# EasyEDA schematic SCH_OSHW_BiDi_SDI_Fiber_Converter_V4_Normal_2024-11-17.json

## Sheets
1 SFP: TITLE: Sheet_1; REV: 1.0; Date: 2024-07-08; Sheet: 1/1; Drawn By: TheStaticTurtle; Company: Your Company
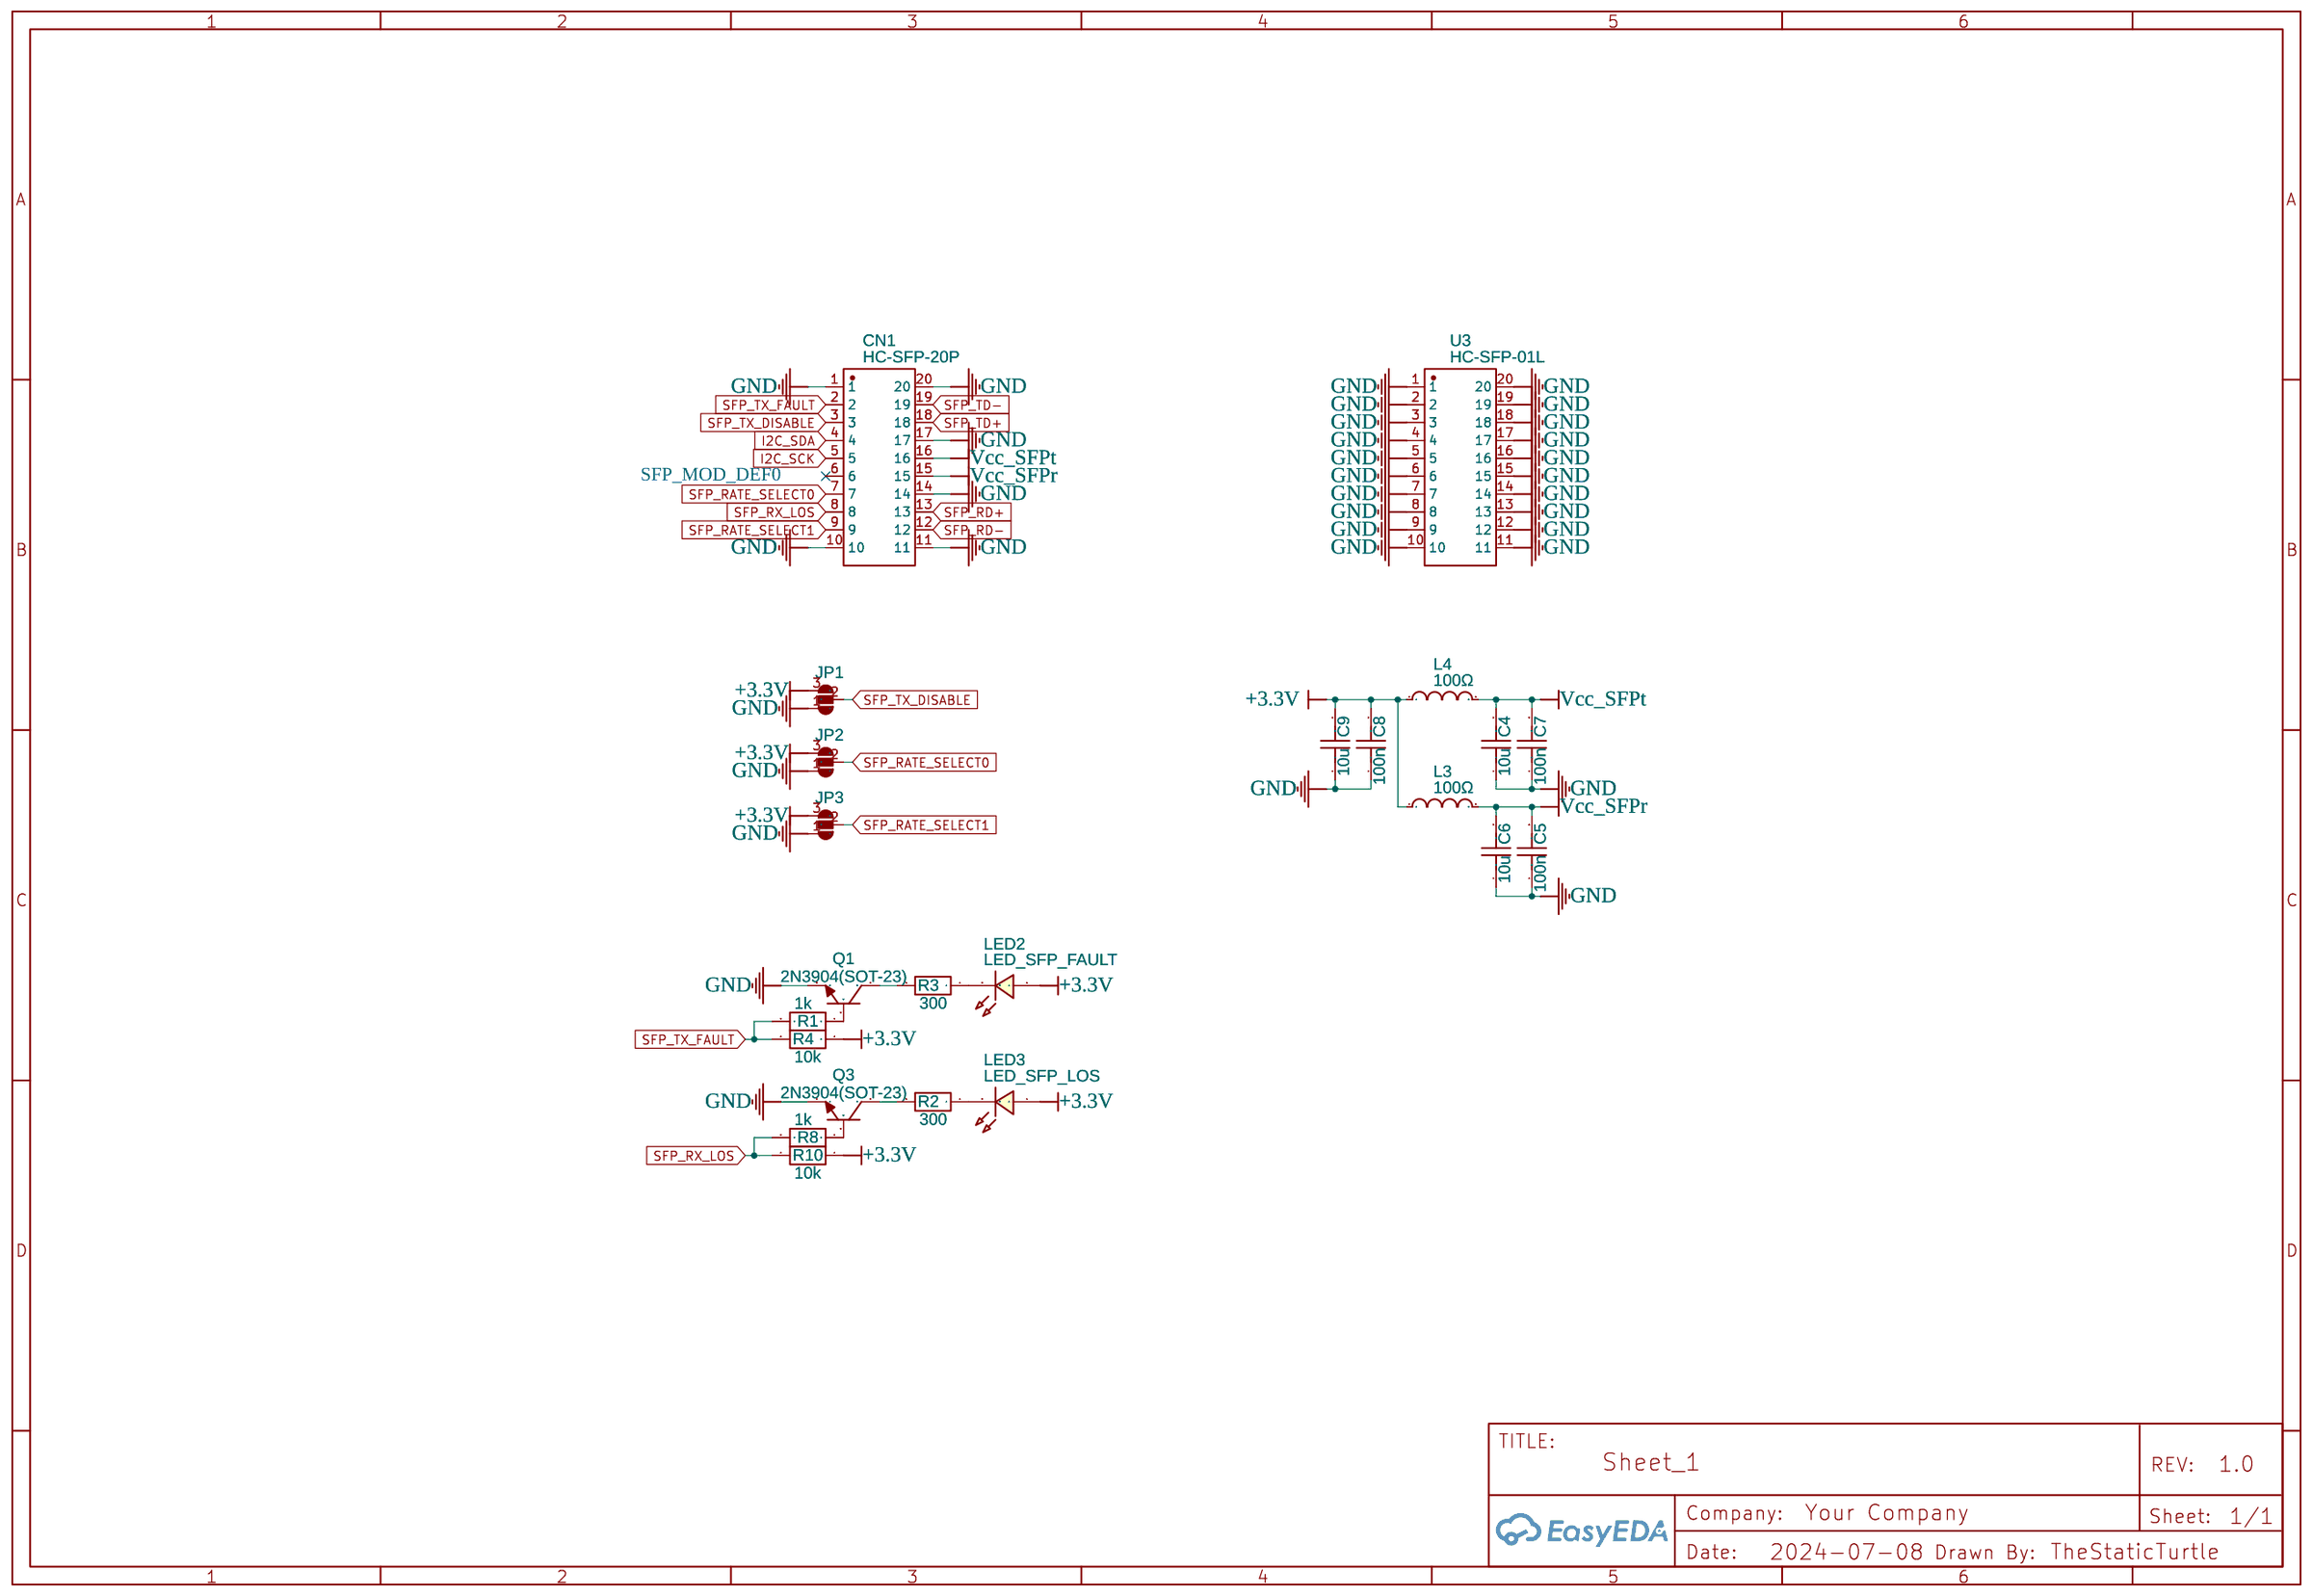
[diagram p0: SFP]
2 Power: Date: 2024-09-07
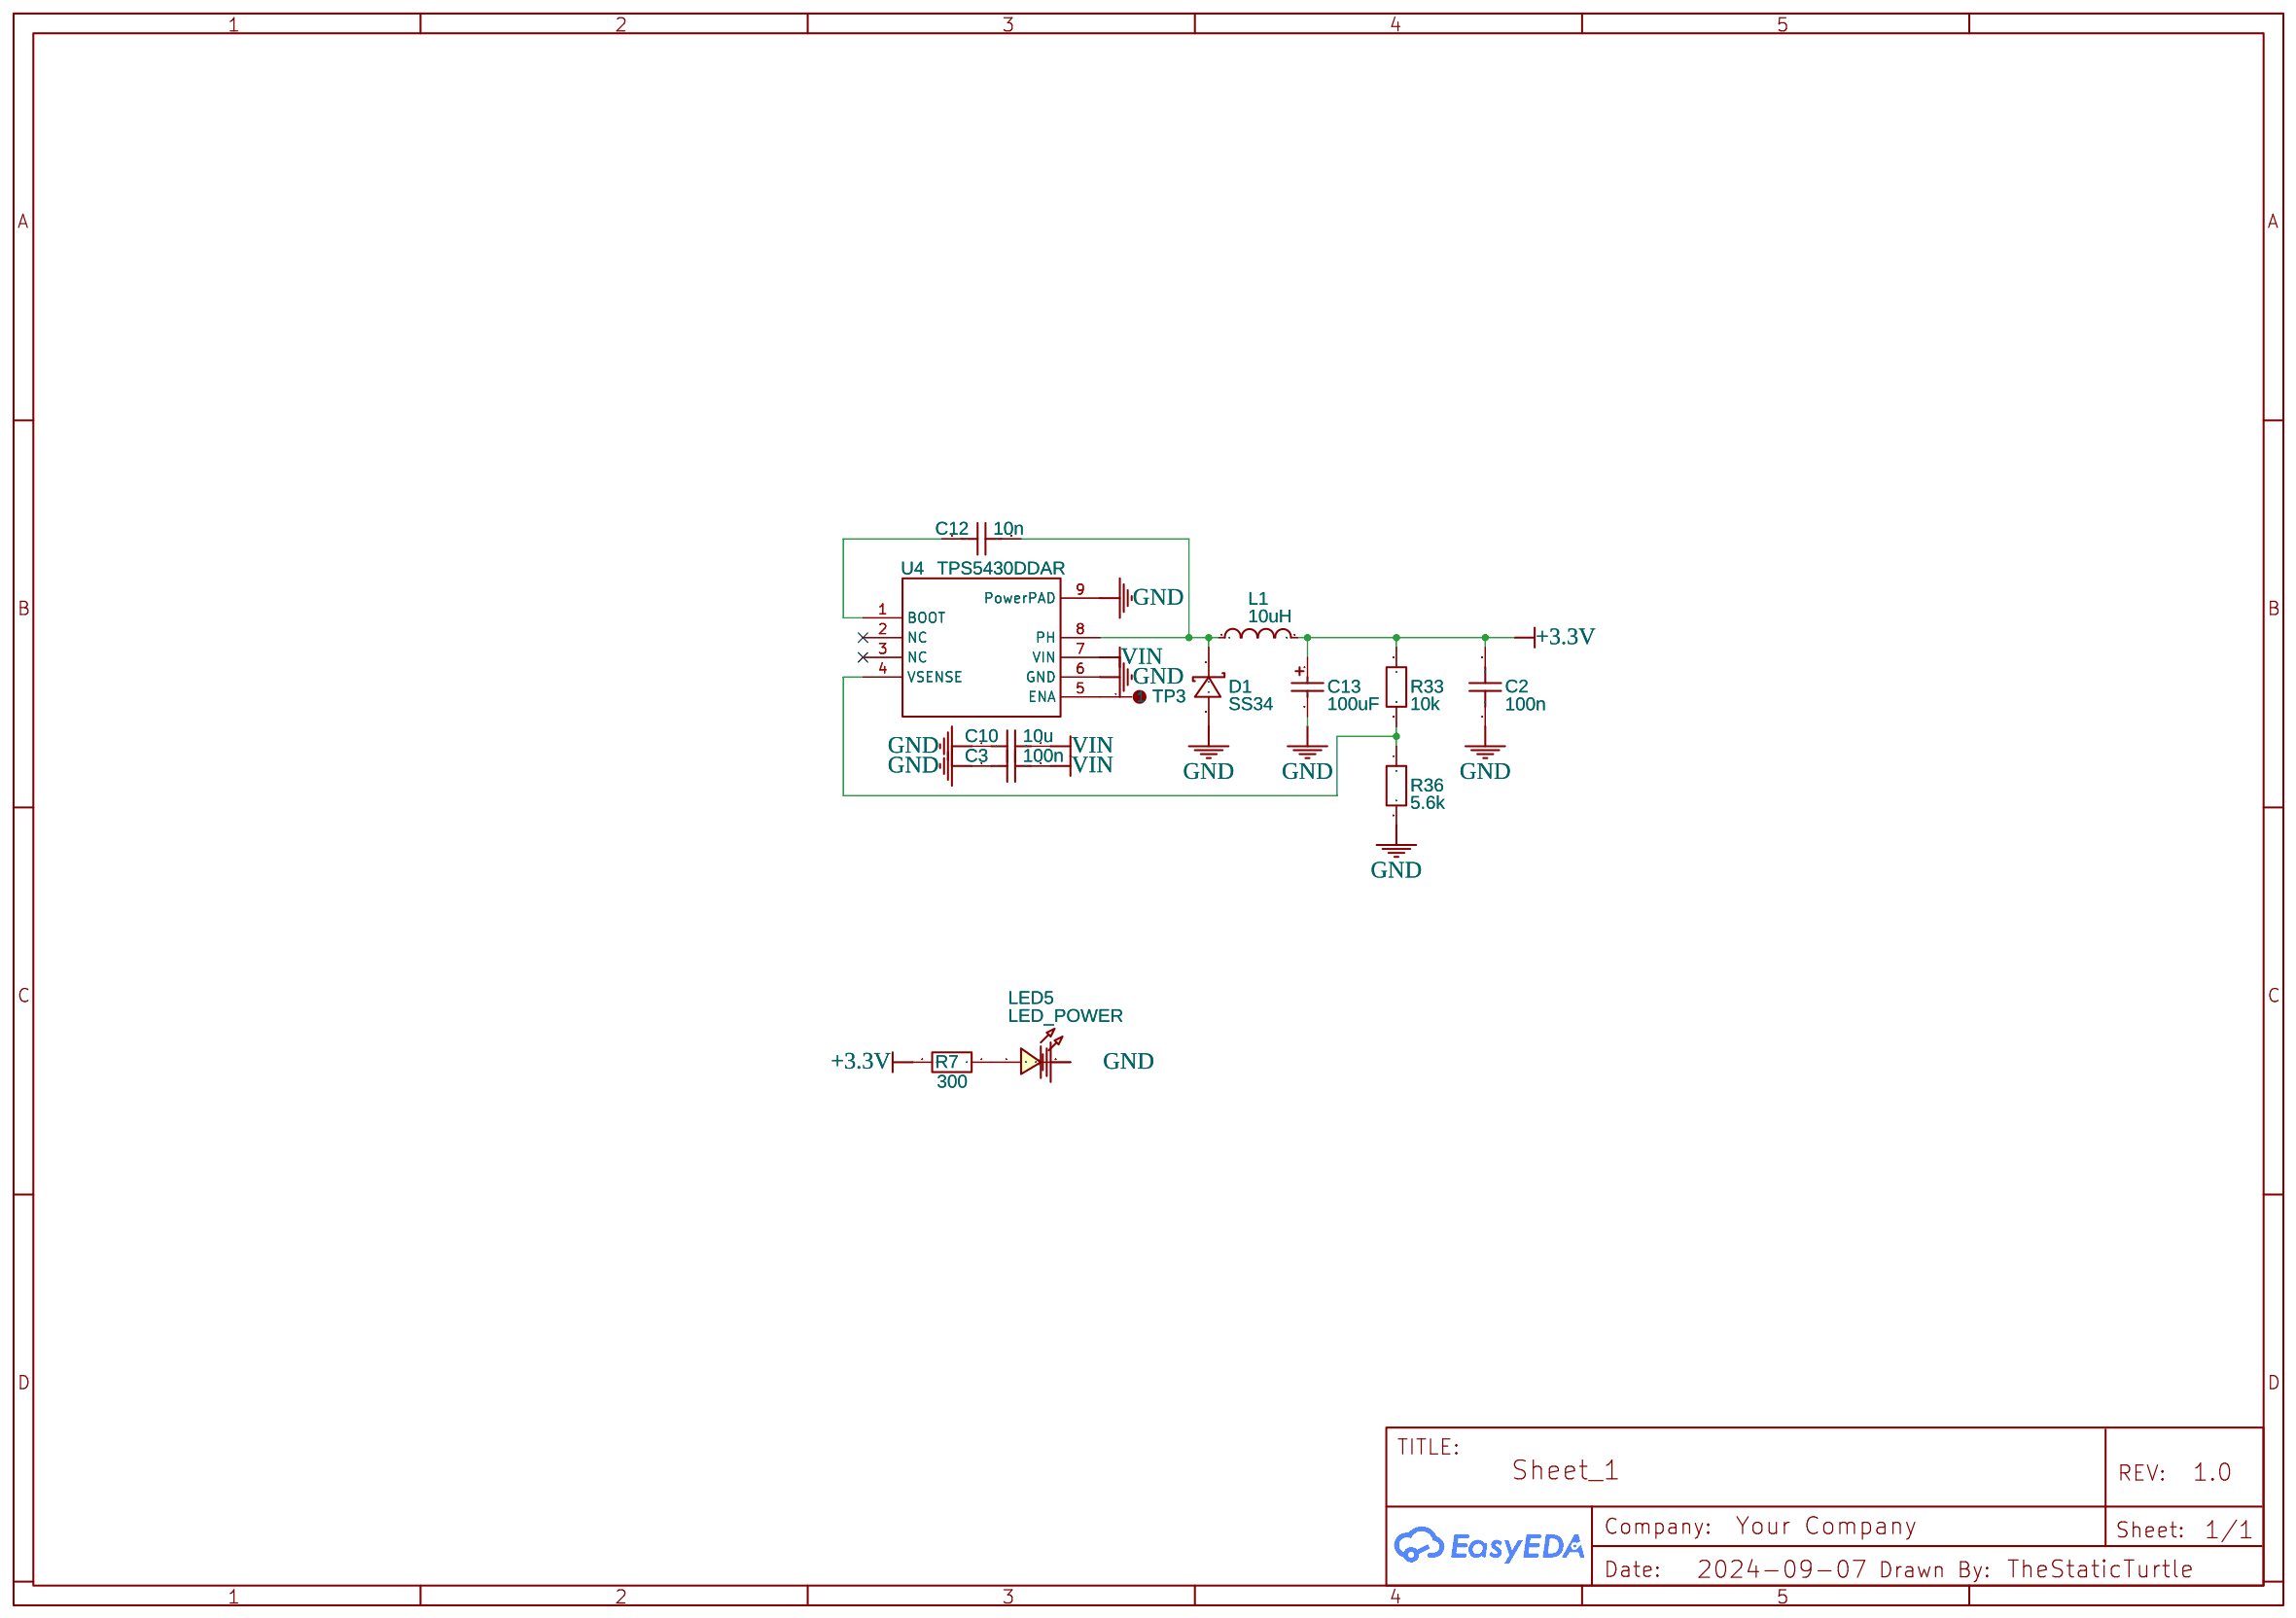
[diagram p1: Power]
3 SDI: Date: 2024-09-07
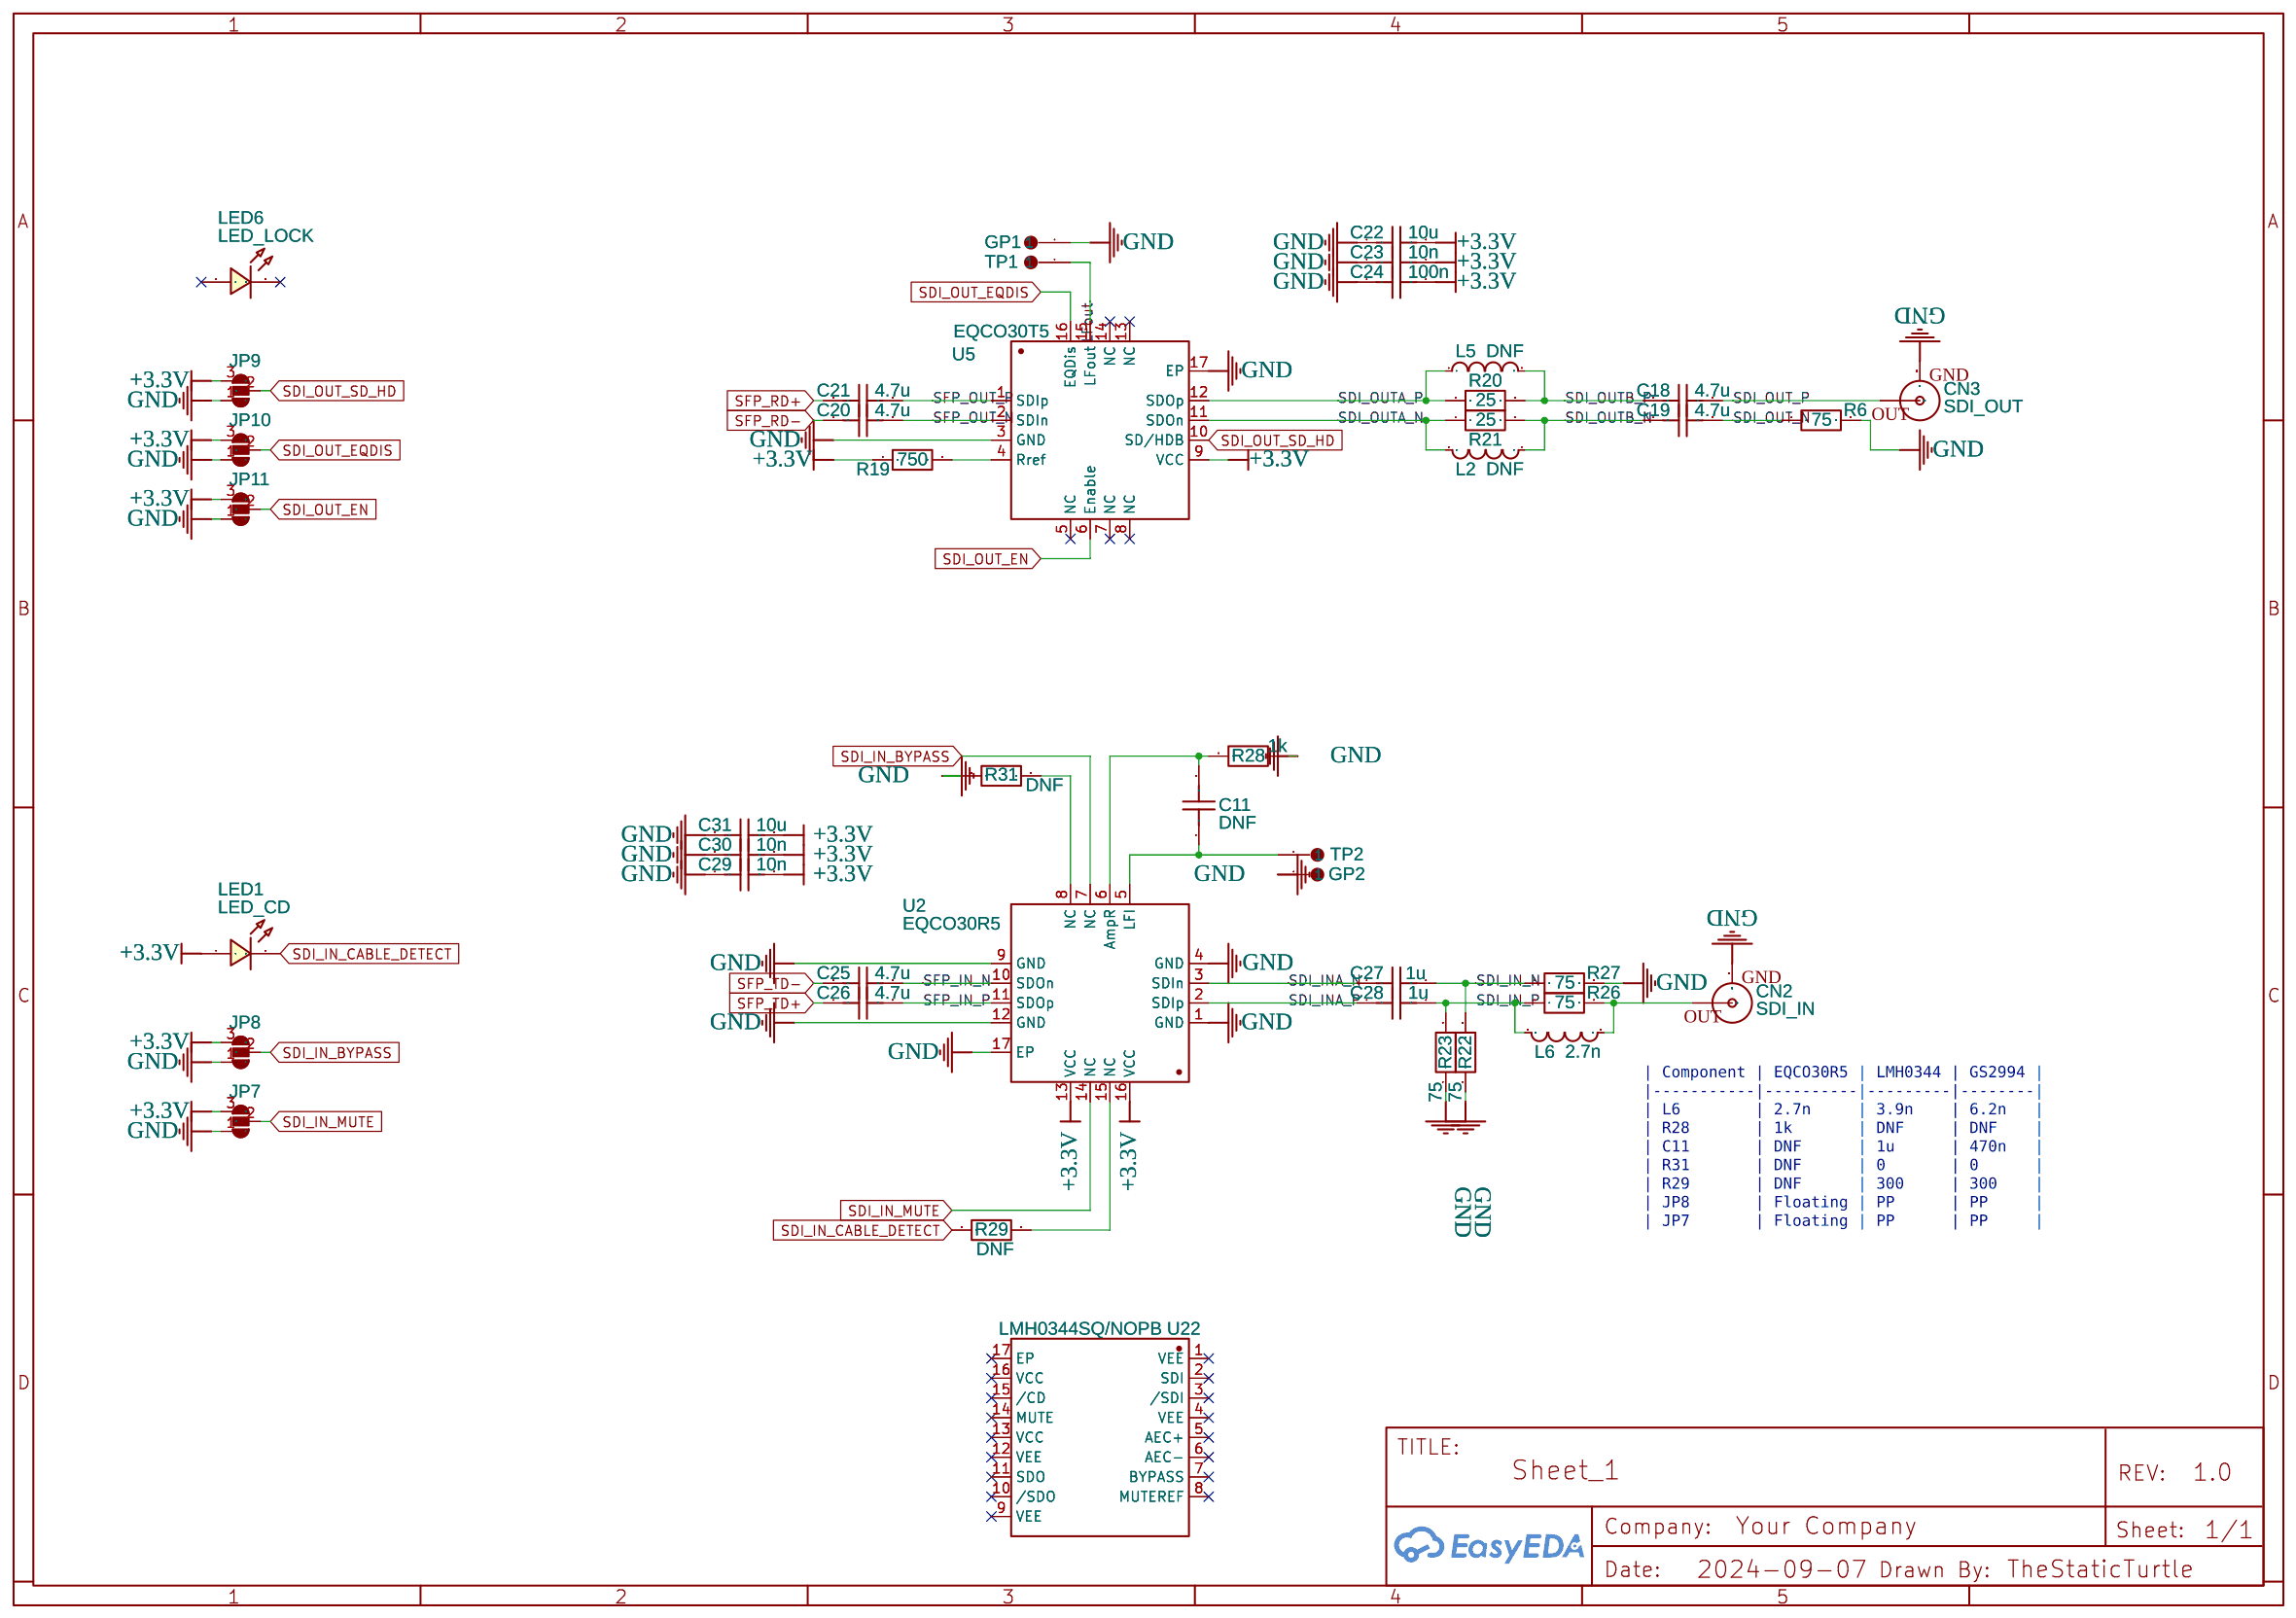
[diagram p2: SDI]
4 Diag: Date: 2024-09-21
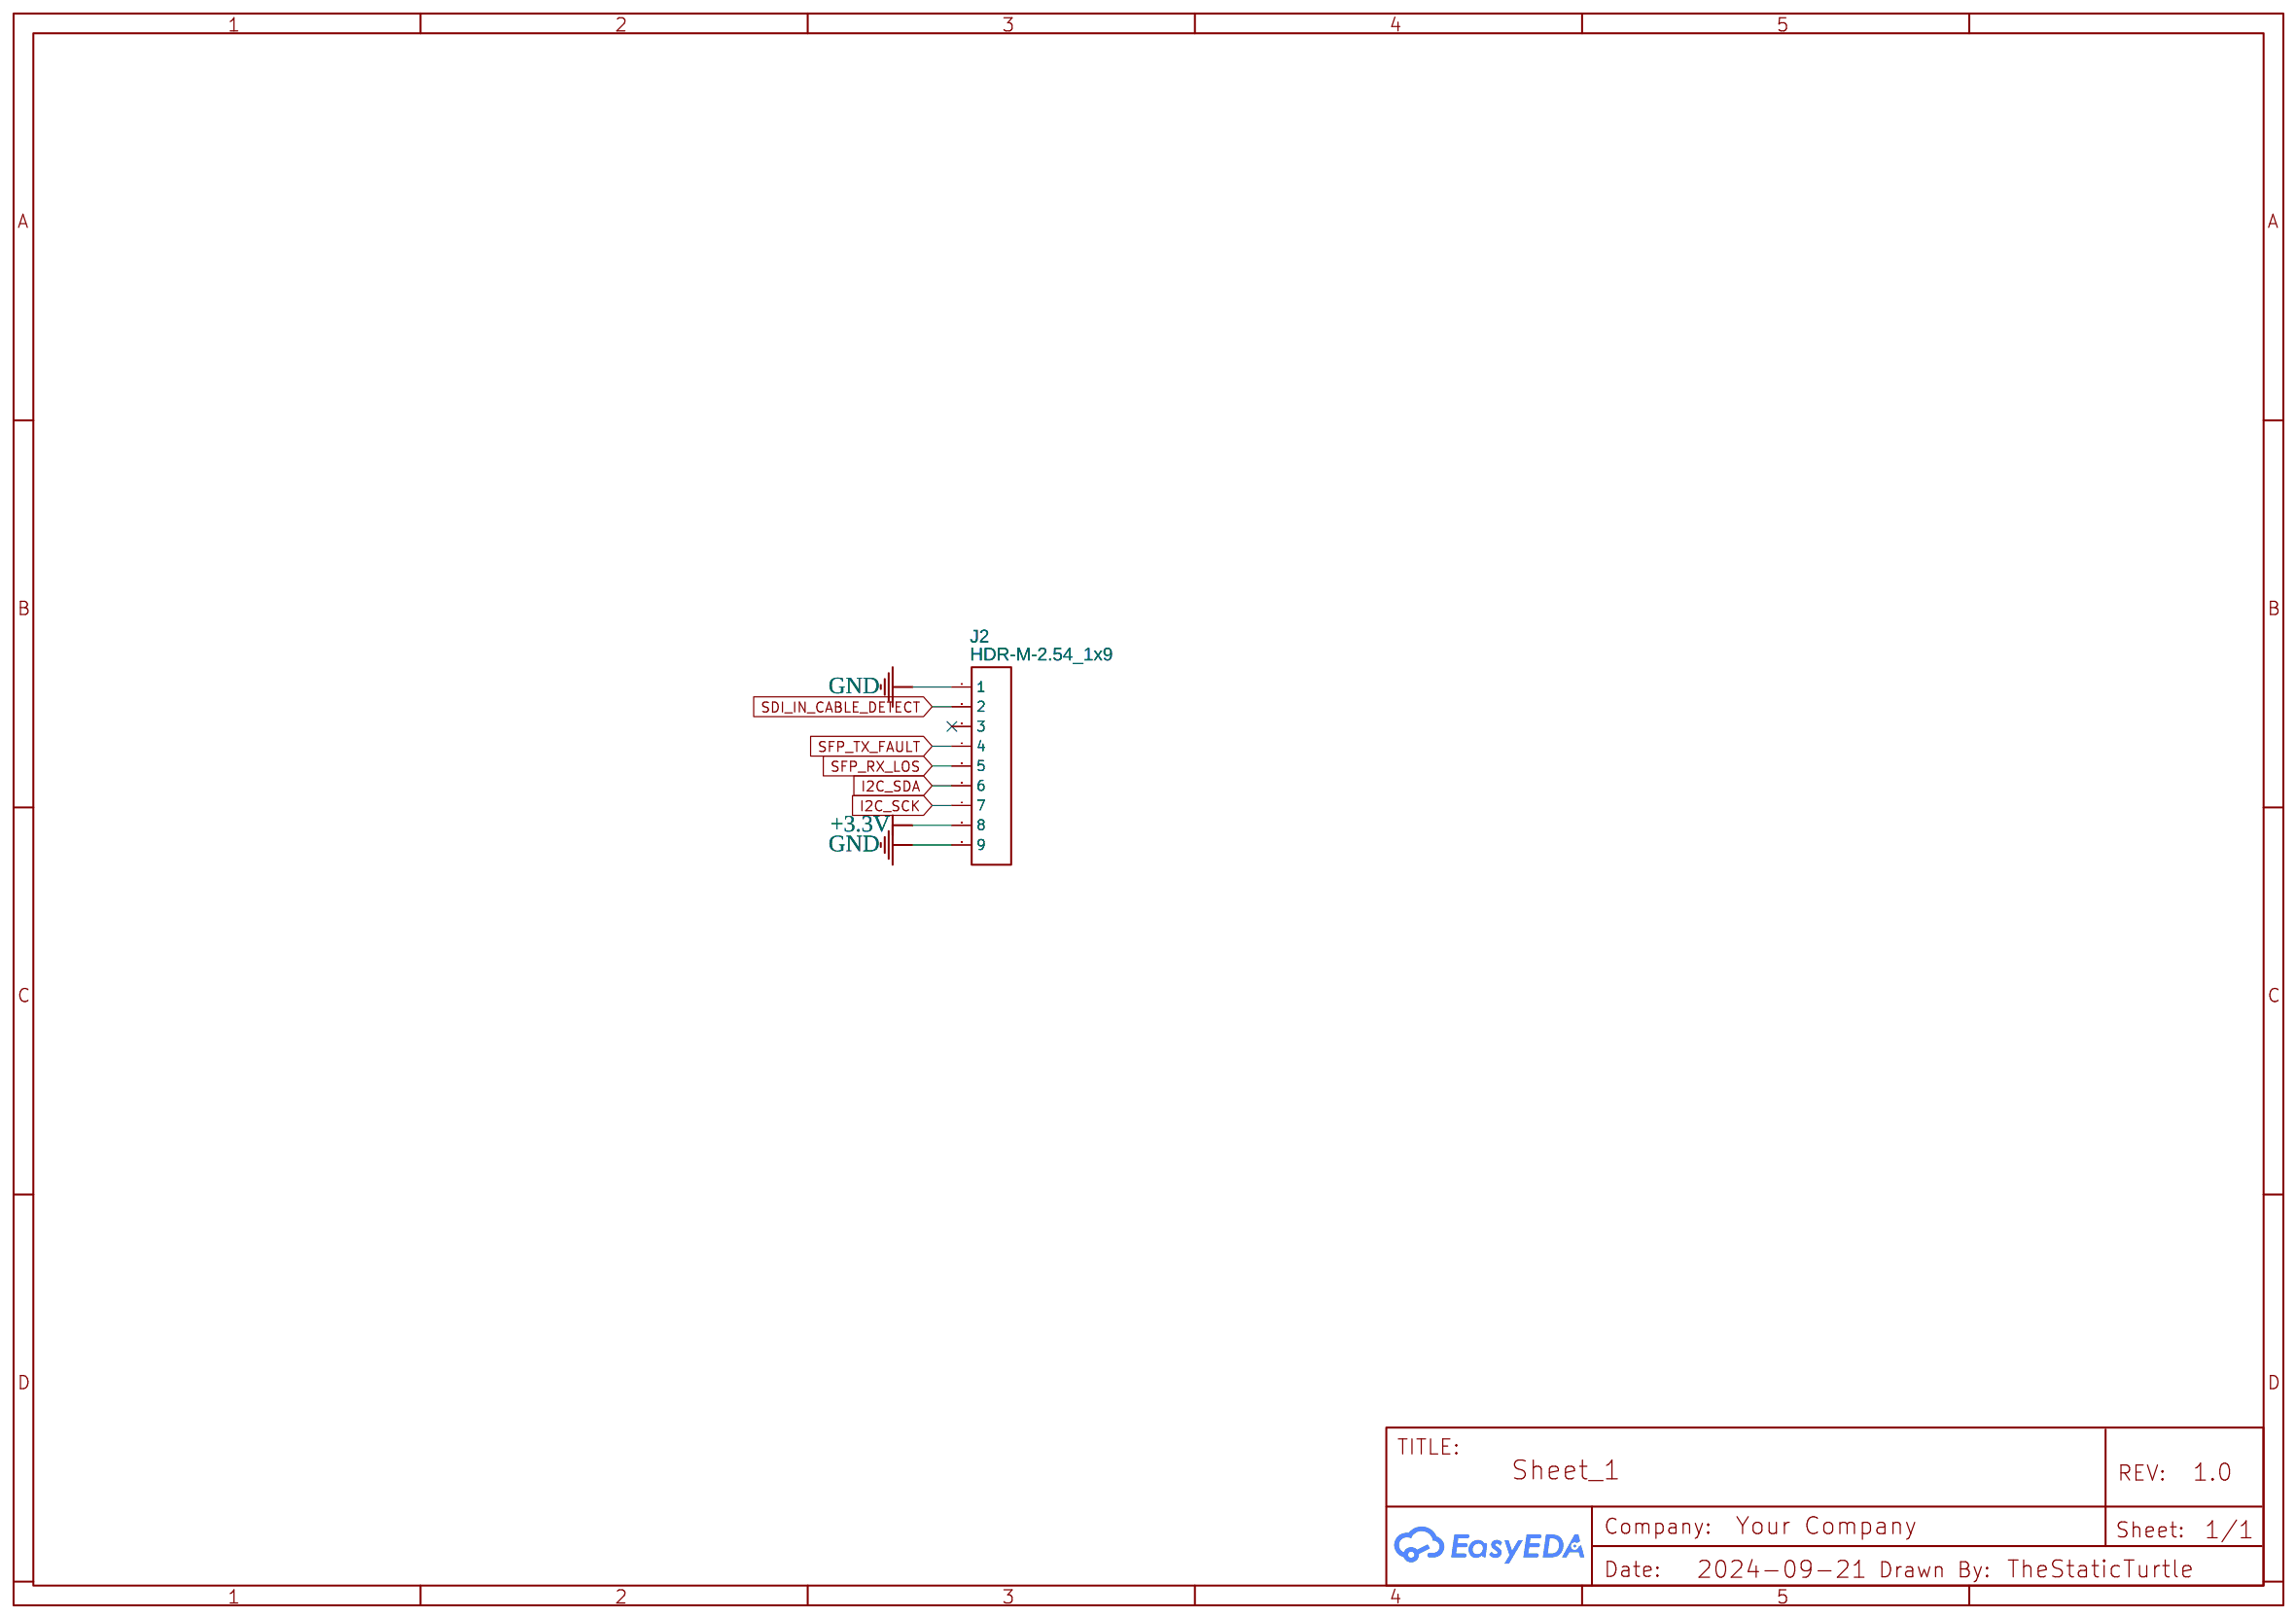
[diagram p3: Diag]

## Parts
sheet Diag
J2  HDR-M-2.54_1x9  [HDR-M-2.54_1X9]
sheet Power
C2  100n  [C0603]
C3  100n  [C0603]
C10  10u  [C0603]
C12  10n  [C0603]
C13  100uF  [CASE-B_3528]
D1  SS34  [SMA_L4.3-W2.6-LS5.2-RD]
L1  10uH  [IND-SMD_L4.0-W4.0]
LED5  LED_POWER  [LED0805_BLUE]
R7  300  [R0603]
R33  10k  [R0603]
R36  5.6k  [R0603]
TP3  TEST-POINT-PTH-1X1  [TESTPOINT-SMD_L1.6-W0.8_RCU-0C]
U4  TPS5430DDAR  [ESOP-8_L4.9-W3.9-P1.27-LS6.0-TL-EP]
sheet SDI
C11  DNF  [C0603]
C18  4.7u  [C0603]
C19  4.7u  [C0603]
C20  4.7u  [C0603]
C21  4.7u  [C0603]
C22  10u  [C0603]
C23  10n  [C0603]
C24  100n  [C0603]
C25  4.7u  [C0603]
C26  4.7u  [C0603]
C27  1u  [C0603]
C28  1u  [C0603]
C29  10n  [C0603]
C30  10n  [C0603]
C31  10u  [C0603]
CN2  SDI_IN  [AMPHENOLRF_034-1030-12G]
CN3  SDI_OUT  [AMPHENOLRF_034-1030-12G]
GP1  TEST-POINT-PTH-1X1  [TESTPOINT-SMD_L1.6-W0.8_RCU-0C]
GP2  TEST-POINT-PTH-1X1  [TESTPOINT-SMD_L1.6-W0.8_RCU-0C]
JP7  SOLDER BRIDGE 3P  [SOLDER BRIDGE 3P]
JP8  SOLDER BRIDGE 3P  [SOLDER BRIDGE 3P]
JP9  SOLDER BRIDGE 3P  [SOLDER BRIDGE 3P]
JP10  SOLDER BRIDGE 3P  [SOLDER BRIDGE 3P]
JP11  SOLDER BRIDGE 3P  [SOLDER BRIDGE 3P]
L2  DNF  [L0603]
L5  DNF  [L0603]
L6  2.7n  [L0603]
LED1  LED_CD  [LED0805_GREEN]
LED6  LED_LOCK  [LED0805_GREEN]
R6  75  [R0603]
R19  750  [R0603]
R20  25  [R0603]
R21  25  [R0603]
R22  75  [R0603]
R23  75  [R0603]
R26  75  [R0603]
R27  75  [R0603]
R28  1k  [R0603]
R29  DNF  [R0603]
R31  DNF  [R0603]
TP1  TEST-POINT-PTH-1X1  [TESTPOINT-SMD_L1.6-W0.8_RCU-0C]
TP2  TEST-POINT-PTH-1X1  [TESTPOINT-SMD_L1.6-W0.8_RCU-0C]
U2  EQCO30R5  [QFN16G-0.65-4X4MM]
U5  EQCO30T5  [QFN16G-0.65-4X4MM]
U22  LMH0344SQ/NOPB  [QFN-16_L4.0-W4.0-P0.65-BL-EP2.6]
sheet SFP
C4  10u  [C0603]
C5  100n  [C0603]
C6  10u  [C0603]
C7  100n  [C0603]
C8  100n  [C0603]
C9  10u  [C0603]
CN1  HC-SFP-20P  [CONN-SMD_20P-P0.80_HCTL_HC-SFP-20P]
JP1  SOLDER BRIDGE 3P  [SOLDER BRIDGE 3P]
JP2  SOLDER BRIDGE 3P  [SOLDER BRIDGE 3P]
JP3  SOLDER BRIDGE 3P  [SOLDER BRIDGE 3P]
L3  100Ω  [L0805]
L4  100Ω  [L0805]
LED2  LED_SFP_FAULT  [LED0805_RED]
LED3  LED_SFP_LOS  [LED0805_RED]
Q1  2N3904(SOT-23)  [SOT-23-3_L2.9-W1.3-P1.90-LS2.4-TR]
Q3  2N3904(SOT-23)  [SOT-23-3_L2.9-W1.3-P1.90-LS2.4-TR]
R1  1k  [R0603]
R2  300  [R0603]
R3  300  [R0603]
R4  10k  [R0603]
R8  1k  [R0603]
R10  10k  [R0603]
U3  HC-SFP-01L  [TH_HC-SFP-01L]

## Library data of the parts
J2 = HDR-M-2.54_1x9: Supplier Part: C225484; Supplier: LCSC; Contributor: LCEDA_Lib
C2-C12 C18-C31 = C_0603_US: Contributor: LCEDA_Lib
C13 = TAJB107K006RNJ: Supplier: LCSC; Manufacturer: Kyocera AVX; Supplier Part: C16133; JLCPCB Part Class: Basic Part
D1 = SS34_C8678: Supplier: LCSC; Manufacturer: MDD(辰达半导体); Supplier Part: C8678
L1 = SWPA4030S100MT: Supplier: LCSC; Manufacturer: Sunlord(顺络); Supplier Part: C38117; JLCPCB Part Class: Extended Part
LED5 = LED-0805_B: Manufacturer: 方舟 ARKLED; Manufacturer Part: D-B080508B1-KS2; Supplier Part: C108412; Contributor: LCEDA_Lib
R1-R4 R6-R8 R10 R19-R23 R26-R29 R31 R33 R36 = R_0603_EU: Contributor: LCEDA_Lib
GP1 GP2 TP1-TP3 = TEST-POINT-PTH-1X1
U4 = TPS5430DDAR: Supplier: LCSC; Manufacturer: TI(德州仪器); Supplier Part: C9864; JLCPCB Part Class: Basic Part
CN2 CN3 = AMPHENOL RF - 034-1030-12G MINI BNC: Supplier Part: 523-34-1030-12G; Supplier: Mouser
JP1-JP3 JP7-JP11 = SOLDER BRIDGE 3P: Contributor: TheStaticTurtle
L2 L5 L6 = L0603_US: Contributor: LCEDA_Lib
LED1 LED6 = LED-0805_G: Manufacturer: 国星光电; Manufacturer Part: NCD0805G1; Supplier Part: C84260; Contributor: LCEDA_Lib
U2 = EQCO30R5: Manufacturer: Microchip; link: https://www.microchip.com/en-us/product/eqco30r5; Contributor: turtleforgaming
U5 = EQCO30T5: Manufacturer: Microchip; link: https://www.microchip.com/en-us/product/eqco30r5; Contributor: turtleforgaming
U22 = LMH0344SQ/NOPB: Contributor: LCSC; Supplier: LCSC; Supplier Part: C191792; Manufacturer: TI(德州仪器); JLCPCB Part Class: Extended Part
CN1 = HC-SFP-20P: Contributor: LCSC; Supplier: LCSC; Supplier Part: C2897291; Manufacturer: HCTL(华灿天禄); JLCPCB Part Class: Extended Part
L3 L4 = GZ2012D101TF: Supplier: LCSC; Manufacturer: Sunlord(顺络); Supplier Part: C1015; JLCPCB Part Class: Basic Part
LED2 LED3 = LED-0805_R: Manufacturer: EVERLIGHT(台湾亿光); Manufacturer Part: 17-21SURC/S530-A3/TR8; Supplier Part: C72037; Contributor: LCEDA_Lib
Q1 Q3 = 2N3904(SOT-23): Supplier: LCSC; Manufacturer: KEC; Manufacturer Part: 2n3904S-RTK/PS; Supplier Part: C18536; Paste Type: SOT-23; Contributor: LCEDA_Lib
U3 = HC-SFP-01L: Contributor: LCSC; Supplier: LCSC; Supplier Part: C2897292; Manufacturer: HCTL(华灿天禄); JLCPCB Part Class: Extended Part

## Nets
+3.3V: C2.2 C8.2 C9.2 C13.1 C22.2 C23.2 C24.2 C29.2 C30.2 C31.2 J2.8 JP1.3(B) JP2.3(B) JP3.3(B) JP7.3(B) JP8.3(B) JP9.3(B) JP10.3(B) JP11.3(B) L1.2 L3.1 L4.1 LED1.1 LED2.1 LED3.1 R4.1 R7.2 R10.1 R19.1 R33.1 U2.13(VCC) U2.16(VCC) U5.9(VCC)
GND: C2.1 C3.1 C4.1 C5.1 C6.1 C7.1 C8.1 C9.1 C10.1 C13.2 C22.1 C23.1 C24.1 C29.1 C30.1 C31.1 CN1.1 CN1.10 CN1.11 CN1.14 CN1.17 CN1.20 CN2.GND CN3.GND D1.2(A) GP1.1 GP2.1 J2.1 J2.9 JP1.1(A) JP2.1(A) JP3.1(A) JP7.1(A) JP8.1(A) JP9.1(A) JP10.1(A) JP11.1(A) LED5.2 Q1.1(E) Q3.1(E) R6.2 R22.1 R23.1 R27.2 R28.1 R31.2 R36.2 U2.1(GND) U2.4(GND) U2.9(GND) U2.12(GND) U2.17(EP) U3.1 U3.2 U3.3 U3.4 U3.5 U3.6 U3.7 U3.8 U3.9 U3.10 U3.11 U3.12 U3.13 U3.14 U3.15 U3.16 U3.17 U3.18 U3.19 U3.20 U4.6(GND) U4.9(PowerPAD) U5.3(GND) U5.17(EP)
Vcc_SFPr: C5.2 C6.2 CN1.15 L3.2
Vcc_SFPt: C4.2 C7.2 CN1.16 L4.2
VIN: C3.2 C10.2 U4.7(VIN)
I2C_SCK: CN1.5 J2.7
I2C_SDA: CN1.4 J2.6
LFout: TP1.1 U5.15(LFout)
SDI_IN_BYPASS: JP8.2(B) U2.7(NC)
SDI_IN_CABLE_DETECT: J2.2 LED1.2 R29.2
SDI_IN_MUTE: JP7.2(B) U2.14(NC)
SDI_IN_N: C27.2 R22.2 R27.1
SDI_IN_P: C28.2 L6.2 R23.2 R26.1
SDI_INA_N: C27.1 U2.3(SDIn)
SDI_INA_P: C28.1 U2.2(SDIp)
SDI_OUT_EN: JP11.2(B) U5.6(Enable)
SDI_OUT_EQDIS: JP10.2(B) U5.16(EQDis)
SDI_OUT_N: C19.2 R6.1
SDI_OUT_P: C18.2 CN3.1(OUT)
SDI_OUT_SD_HD: JP9.2(B) U5.10(SD/HDB)
SDI_OUTA_N: L2.2 R21.1 U5.11(SDOn)
SDI_OUTA_P: L5.1 R20.1 U5.12(SDOp)
SDI_OUTB_N: C19.1 L2.1 R21.2
SDI_OUTB_P: C18.1 L5.2 R20.2
SFP_IN_N: C25.2 U2.10(SDOn)
SFP_IN_P: C26.2 U2.11(SDOp)
SFP_OUT_N: C20.2 U5.2(SDIn)
SFP_OUT_P: C21.2 U5.1(SDIp)
SFP_RATE_SELECT0: CN1.7 JP2.2(B)
SFP_RATE_SELECT1: CN1.9 JP3.2(B)
SFP_RD+: C21.1 CN1.13
SFP_RD-: C20.1 CN1.12
SFP_RX_LOS: CN1.8 J2.5 R8.2 R10.2
SFP_TD+: C26.1 CN1.18
SFP_TD-: C25.1 CN1.19
SFP_TX_DISABLE: CN1.3 JP1.2(B)
SFP_TX_FAULT: CN1.2 J2.4 R1.2 R4.2
Net-(C11-1): C11.1 TP2.1 U2.5(LFI)
Net-(C11-2): C11.2 R28.2 U2.6(AmpR)
Net-(C12-1): C12.1 U4.1(BOOT)
Net-(C12-2): C12.2 D1.1(K) L1.1 U4.8(PH)
Net-(CN2-1): CN2.1(OUT) L6.1 R26.2
Net-(LED2-2): LED2.2 R3.1
Net-(LED3-2): LED3.2 R2.1
Net-(LED5-1): LED5.1 R7.1
Net-(Q1-2): Q1.2(B) R1.1
Net-(Q1-3): Q1.3(C) R3.2
Net-(Q3-2): Q3.2(B) R8.1
Net-(Q3-3): Q3.3(C) R2.2
Net-(R19-2): R19.2 U5.4(Rref)
Net-(R29-1): R29.1 U2.15(NC)
Net-(R31-1): R31.1 U2.8(NC)
Net-(R33-2): R33.2 R36.1 U4.4(VSENSE)
Net-(TP3-1): TP3.1 U4.5(ENA)

Not connected (* = marked no-connect by the designer): CN1 6*; J2 3*; LED6 1* 2*; U4 2(NC)* 3(NC)*; U5 5(NC)* 7(NC)* 8(NC)* 13(NC)* 14(NC)*; U22 1(VEE)* 2(SDI)* 3(/SDI)* 4(VEE)* 5(AEC+)* 6(AEC-)* 7(BYPASS)* 8(MUTEREF)* 9(VEE)* 10(/SDO)* 11(SDO)* 12(VEE)* 13(VCC)* 14(MUTE)* 15(/CD)* 16(VCC)* 17(EP)*

## Notes on the sheets
sheet 1
- SFP_MOD_DEF0
sheet 3
- | Component | EQCO30R5 | LMH0344 | GS2994 |
  |-----------|----------|---------|--------|
  | L6        | 2.7n     | 3.9n    | 6.2n   |
  | R28       | 1k       | DNF     | DNF    |
  | C11       | DNF      | 1u      | 470n   |
  | R31       | DNF      | 0       | 0      |
  | R29       | DNF      | 300     | 300    |
  | JP8       | Floating | PP      | PP     |
  | JP7       | Floating | PP      | PP     |
